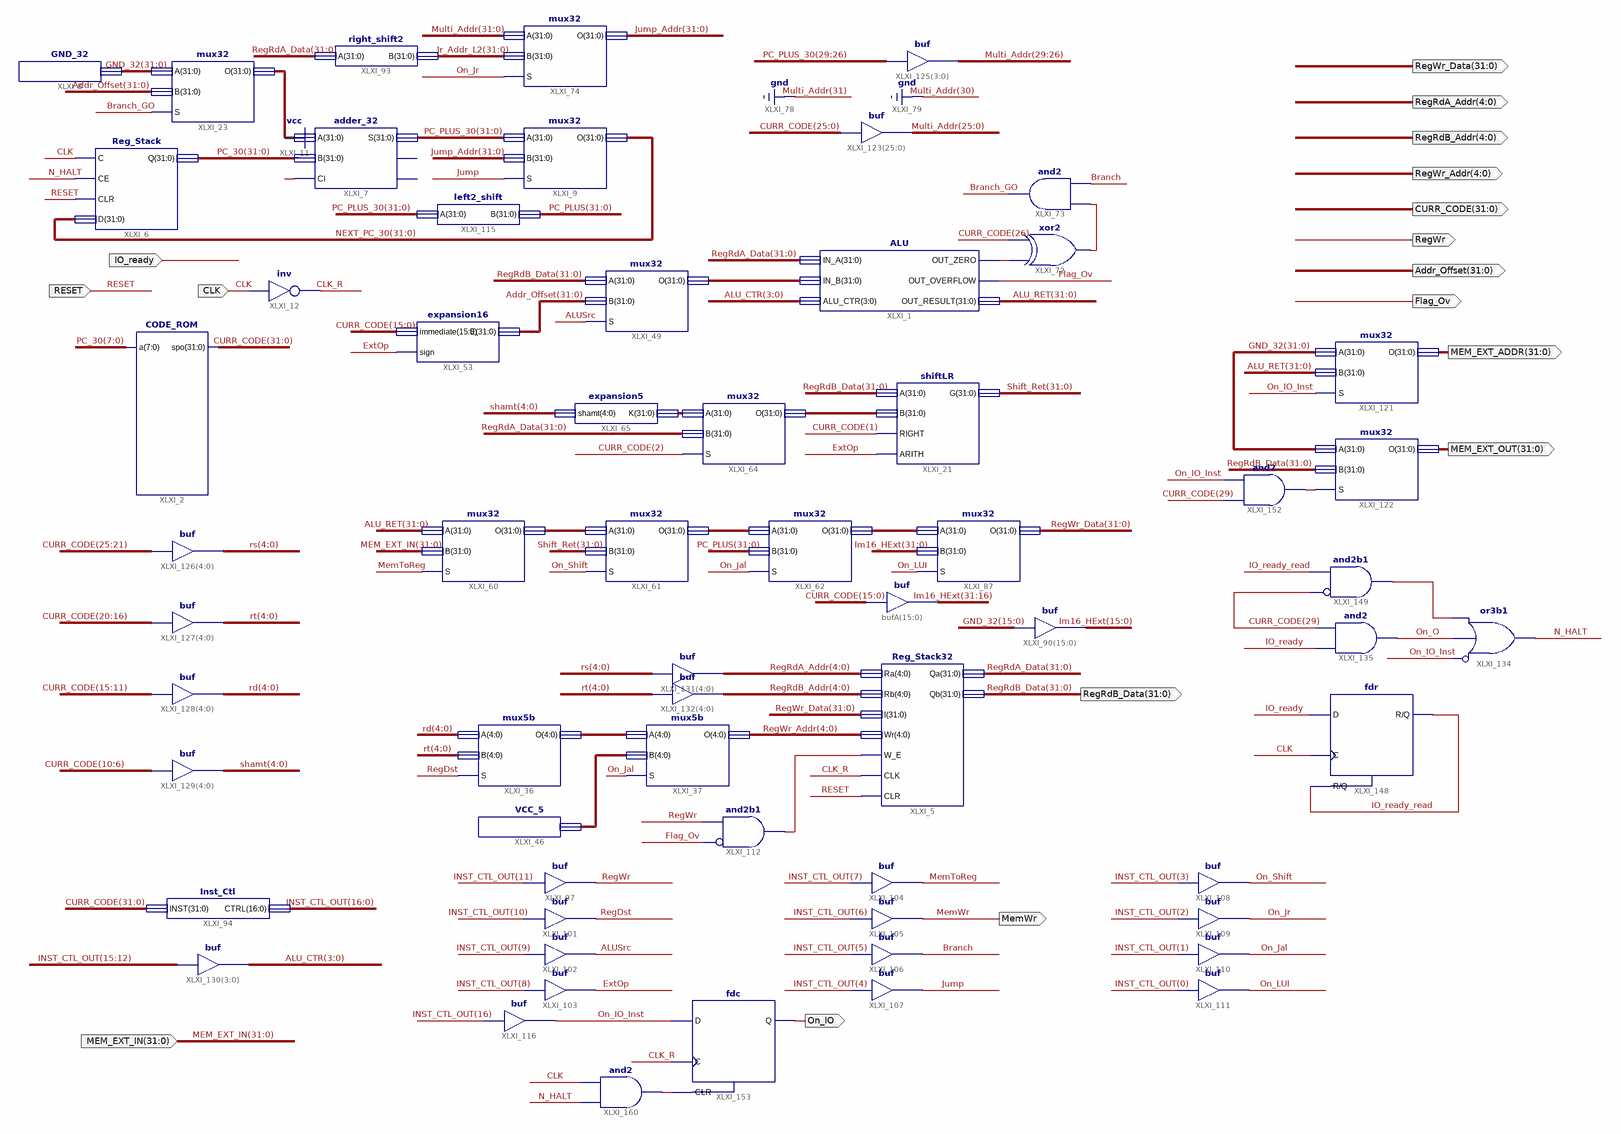
[diagram p0: schematic sheet 1]
// Xilinx ISE schematic MIPS_CPU_All.sch (artix7) as structural Verilog: 61 symbols, 17 ports
module MIPS_CPU_All (
  input  RESET,
  input  CLK,
  input  [31:0] MEM_EXT_IN,
  input  IO_ready,
  output [31:0] CURR_CODE,
  output [31:0] Addr_Offset,
  output [31:0] RegWr_Data,
  output [31:0] RegRdB_Data,
  output RegWr,
  output [4:0] RegWr_Addr,
  output [4:0] RegRdA_Addr,
  output [4:0] RegRdB_Addr,
  output MemWr,
  output Flag_Ov,
  output [31:0] MEM_EXT_ADDR,
  output [31:0] MEM_EXT_OUT,
  output On_IO
);

  wire ALUSrc, Branch, Branch_GO, CLK_R, ExtOp, IO_ready_read, Jump, MemToReg, N_HALT, On_IO_Inst, On_Jal,
       On_Jr, On_LUI, On_O, On_Shift, RegDst, XLXN_178, XLXN_180, XLXN_192, XLXN_205, XLXN_211, XLXN_222;
  wire [3:0] ALU_CTR;
  wire [4:0] rd, rs, rt, shamt, XLXN_84, XLXN_99;
  wire [16:0] INST_CTL_OUT;
  wire [29:0] Multi_Addr;
  wire [31:0] ALU_RET, GND_32, Im16_HExt, Jr_Addr_L2, Jump_Addr, NEXT_PC_30, PC_30, PC_PLUS, PC_PLUS_30,
       RegRdA_Data, Shift_Ret, XLXN_53, XLXN_103, XLXN_142, XLXN_143, XLXN_154, XLXN_156, XLXN_191;

  CODE_ROM XLXI_2 (.a(PC_30[7:0]), .spo(CURR_CODE));
  mux32 XLXI_23 (.A(GND_32), .B(Addr_Offset), .S(Branch_GO), .O(XLXN_53));
  Reg_Stack XLXI_6 (.C(CLK), .CE(N_HALT), .CLR(RESET), .D(NEXT_PC_30), .Q(PC_30));
  GND_32 XLXI_8 (.GND_OUT(GND_32));
  adder_32 XLXI_7 (.A(XLXN_53), .B(PC_30), .CI(1'b1), .S(PC_PLUS_30));  // open: CO, OFL
  mux32 XLXI_9 (.A(PC_PLUS_30), .B(Jump_Addr), .S(Jump), .O(NEXT_PC_30));
  not XLXI_12 (CLK_R, CLK);
  ALU XLXI_1 (
    .ALU_CTR(ALU_CTR), .IN_A(RegRdA_Data), .IN_B(XLXN_103), .OUT_OVERFLOW(Flag_Ov), .OUT_RESULT(ALU_RET),
    .OUT_ZERO(XLXN_178));
  mux32 XLXI_49 (.A(RegRdB_Data), .B(Addr_Offset), .S(ALUSrc), .O(XLXN_103));
  expansion16 XLXI_53 (.immediate(CURR_CODE[15:0]), .sign(ExtOp), .E(Addr_Offset));
  Reg_Stack32 XLXI_5 (
    .CLK(CLK_R), .CLR(RESET), .I(RegWr_Data), .Qa(RegRdA_Data), .Qb(RegRdB_Data), .Ra(RegRdA_Addr),
    .Rb(RegRdB_Addr), .Wr(RegWr_Addr), .W_E(XLXN_192));
  mux5b XLXI_36 (.A(rd), .B(rt), .S(RegDst), .O(XLXN_84));
  mux5b XLXI_37 (.A(XLXN_84), .B(XLXN_99), .S(On_Jal), .O(RegWr_Addr));
  VCC_5 XLXI_46 (.VCC_OUT(XLXN_99));
  mux32 XLXI_64 (.A(XLXN_156), .B(RegRdA_Data), .S(CURR_CODE[2]), .O(XLXN_154));
  expansion5 XLXI_65 (.shamt(shamt), .K(XLXN_156));
  shiftLR XLXI_21 (.A(RegRdB_Data), .B(XLXN_154), .RIGHT(CURR_CODE[1]), .ARITH(ExtOp), .G(Shift_Ret));
  xor XLXI_72 (XLXN_180, XLXN_178, CURR_CODE[26]);
  and XLXI_73 (Branch_GO, XLXN_180, Branch);
  mux32 XLXI_74 (.A({2'b00, Multi_Addr}), .B(Jr_Addr_L2), .S(On_Jr), .O(Jump_Addr));
  mux32 XLXI_62 (.A(XLXN_142), .B(PC_PLUS), .S(On_Jal), .O(XLXN_191));
  mux32 XLXI_61 (.A(XLXN_143), .B(Shift_Ret), .S(On_Shift), .O(XLXN_142));
  mux32 XLXI_60 (.A(ALU_RET), .B(MEM_EXT_IN), .S(MemToReg), .O(XLXN_143));
  mux32 XLXI_87 (.A(XLXN_191), .B(Im16_HExt), .S(On_LUI), .O(RegWr_Data));
  assign Im16_HExt[31:16] = CURR_CODE[15:0];  // buf bufA[15..0], 16 bits wide
  assign Im16_HExt[15:0] = GND_32[15:0];  // buf XLXI_90[15..0], 16 bits wide
  right_shift2 XLXI_93 (.A(RegRdA_Data), .B(Jr_Addr_L2));
  Inst_Ctl XLXI_94 (.CTRL(INST_CTL_OUT), .INST(CURR_CODE));
  buf XLXI_97 (RegWr, INST_CTL_OUT[11]);
  buf XLXI_101 (RegDst, INST_CTL_OUT[10]);
  buf XLXI_102 (ALUSrc, INST_CTL_OUT[9]);
  buf XLXI_103 (ExtOp, INST_CTL_OUT[8]);
  buf XLXI_104 (MemToReg, INST_CTL_OUT[7]);
  buf XLXI_105 (MemWr, INST_CTL_OUT[6]);
  buf XLXI_106 (Branch, INST_CTL_OUT[5]);
  buf XLXI_107 (Jump, INST_CTL_OUT[4]);
  buf XLXI_108 (On_Shift, INST_CTL_OUT[3]);
  buf XLXI_109 (On_Jr, INST_CTL_OUT[2]);
  buf XLXI_110 (On_Jal, INST_CTL_OUT[1]);
  buf XLXI_111 (On_LUI, INST_CTL_OUT[0]);
  and XLXI_112 (XLXN_192, ~Flag_Ov, RegWr);  // and2b1
  left2_shift XLXI_115 (.A(PC_PLUS_30), .B(PC_PLUS));
  mux32 XLXI_121 (.A(GND_32), .B(ALU_RET), .S(On_IO_Inst), .O(MEM_EXT_ADDR));
  mux32 XLXI_122 (.A(GND_32), .B(RegRdB_Data), .S(XLXN_211), .O(MEM_EXT_OUT));
  assign Multi_Addr[25:0] = CURR_CODE[25:0];  // buf XLXI_123[25..0], 26 bits wide
  assign Multi_Addr[29:26] = PC_PLUS_30[29:26];  // buf XLXI_125[3..0], 4 bits wide
  assign rs = CURR_CODE[25:21];  // buf XLXI_126[4..0], 5 bits wide
  assign rt = CURR_CODE[20:16];  // buf XLXI_127[4..0], 5 bits wide
  assign rd = CURR_CODE[15:11];  // buf XLXI_128[4..0], 5 bits wide
  assign shamt = CURR_CODE[10:6];  // buf XLXI_129[4..0], 5 bits wide
  assign ALU_CTR = INST_CTL_OUT[15:12];  // buf XLXI_130[3..0], 4 bits wide
  assign RegRdB_Addr = rt;  // buf XLXI_132[4..0], 5 bits wide
  assign RegRdA_Addr = rs;  // buf XLXI_131[4..0], 5 bits wide
  or XLXI_134 (N_HALT, ~On_IO_Inst, On_O, XLXN_205);  // or3b1
  and XLXI_135 (On_O, IO_ready, CURR_CODE[29]);
  fdr XLXI_148 (.C(CLK), .D(IO_ready), .R(IO_ready_read), .Q(IO_ready_read));
  and XLXI_149 (XLXN_205, ~CURR_CODE[29], IO_ready_read);  // and2b1
  and XLXI_152 (XLXN_211, CURR_CODE[29], On_IO_Inst);
  buf XLXI_116 (On_IO_Inst, INST_CTL_OUT[16]);
  fdc XLXI_153 (.C(CLK_R), .CLR(XLXN_222), .D(On_IO_Inst), .Q(On_IO));
  and XLXI_160 (XLXN_222, N_HALT, CLK);
endmodule
